# Altium schematic sheet MOD.SchDoc: Modification Information
size B; DrawnBy: DJW; DocumentNumber: 5; SheetNumber: 2; SheetTotal: 2
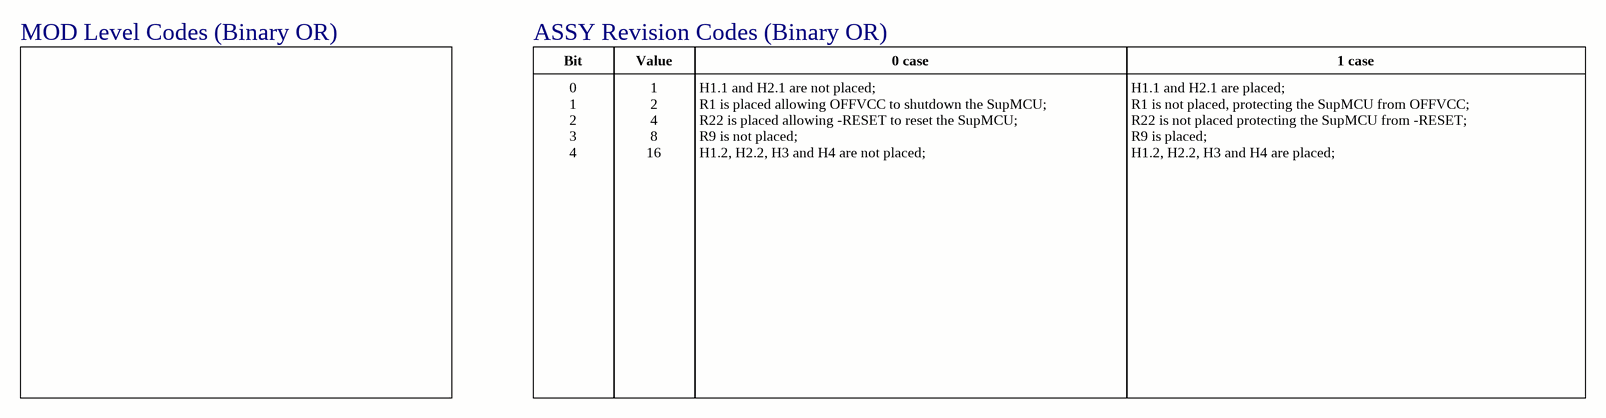
[diagram p0: MOD.SchDoc]

## Notes on the sheet
- MOD Level Codes (Binary OR)
- ASSY Revision Codes (Binary OR)
- Bit
- Value
- 0 case
- 1 case
- 0
  1
  2
  3
  4
- 1
  2
  4
  8
  16
- H1.1 and H2.1 are not placed;
  R1 is placed allowing OFFVCC to shutdown the SupMCU;
  R22 is placed allowing -RESET to reset the SupMCU;
  R9 is not placed;
  H1.2, H2.2, H3 and H4 are not placed;
- H1.1 and H2.1 are placed;
  R1 is not placed, protecting the SupMCU from OFFVCC;
  R22 is not placed protecting the SupMCU from -RESET;
  R9 is placed;
  H1.2, H2.2, H3 and H4 are placed;
- Title:
- 750 Naples Street
- San Francisco, California  94112
- Doc. Rev: 01
- File:
- Part Number:
- Revision:
- Sheet:
- (C) 2001-2017 Pumpkin, Inc.
- Date:
- Size:
- B
- Drawn By: